# Altium schematic sheet 6_USB_PCIe_STAT PHY.schdoc
size 431 x 309 mm; Symbol: Sheet-Symbol_A4; Device: Sheet-Symbol_A4; Company: 嘉立创EDA; Version: V1.0; Page Size: A4; @Project Name: RK3568核心板; @Page Count: 13; @Update Date: 2024-10-10; @Create Date: 2024-10-09; @Schematic Name: Schematic1; @Page No: 5; @Page Name: USB/PCIe/STAT PHY; @Board Name: Board1; @Create Time: 16:47:07; @Update Time: 09:52:56; Width: 1655; Height: 1170; Region Start: 1; X Region Count: 6; Y Region Count: 4; Blade Width: 10; Title Block Position: 3
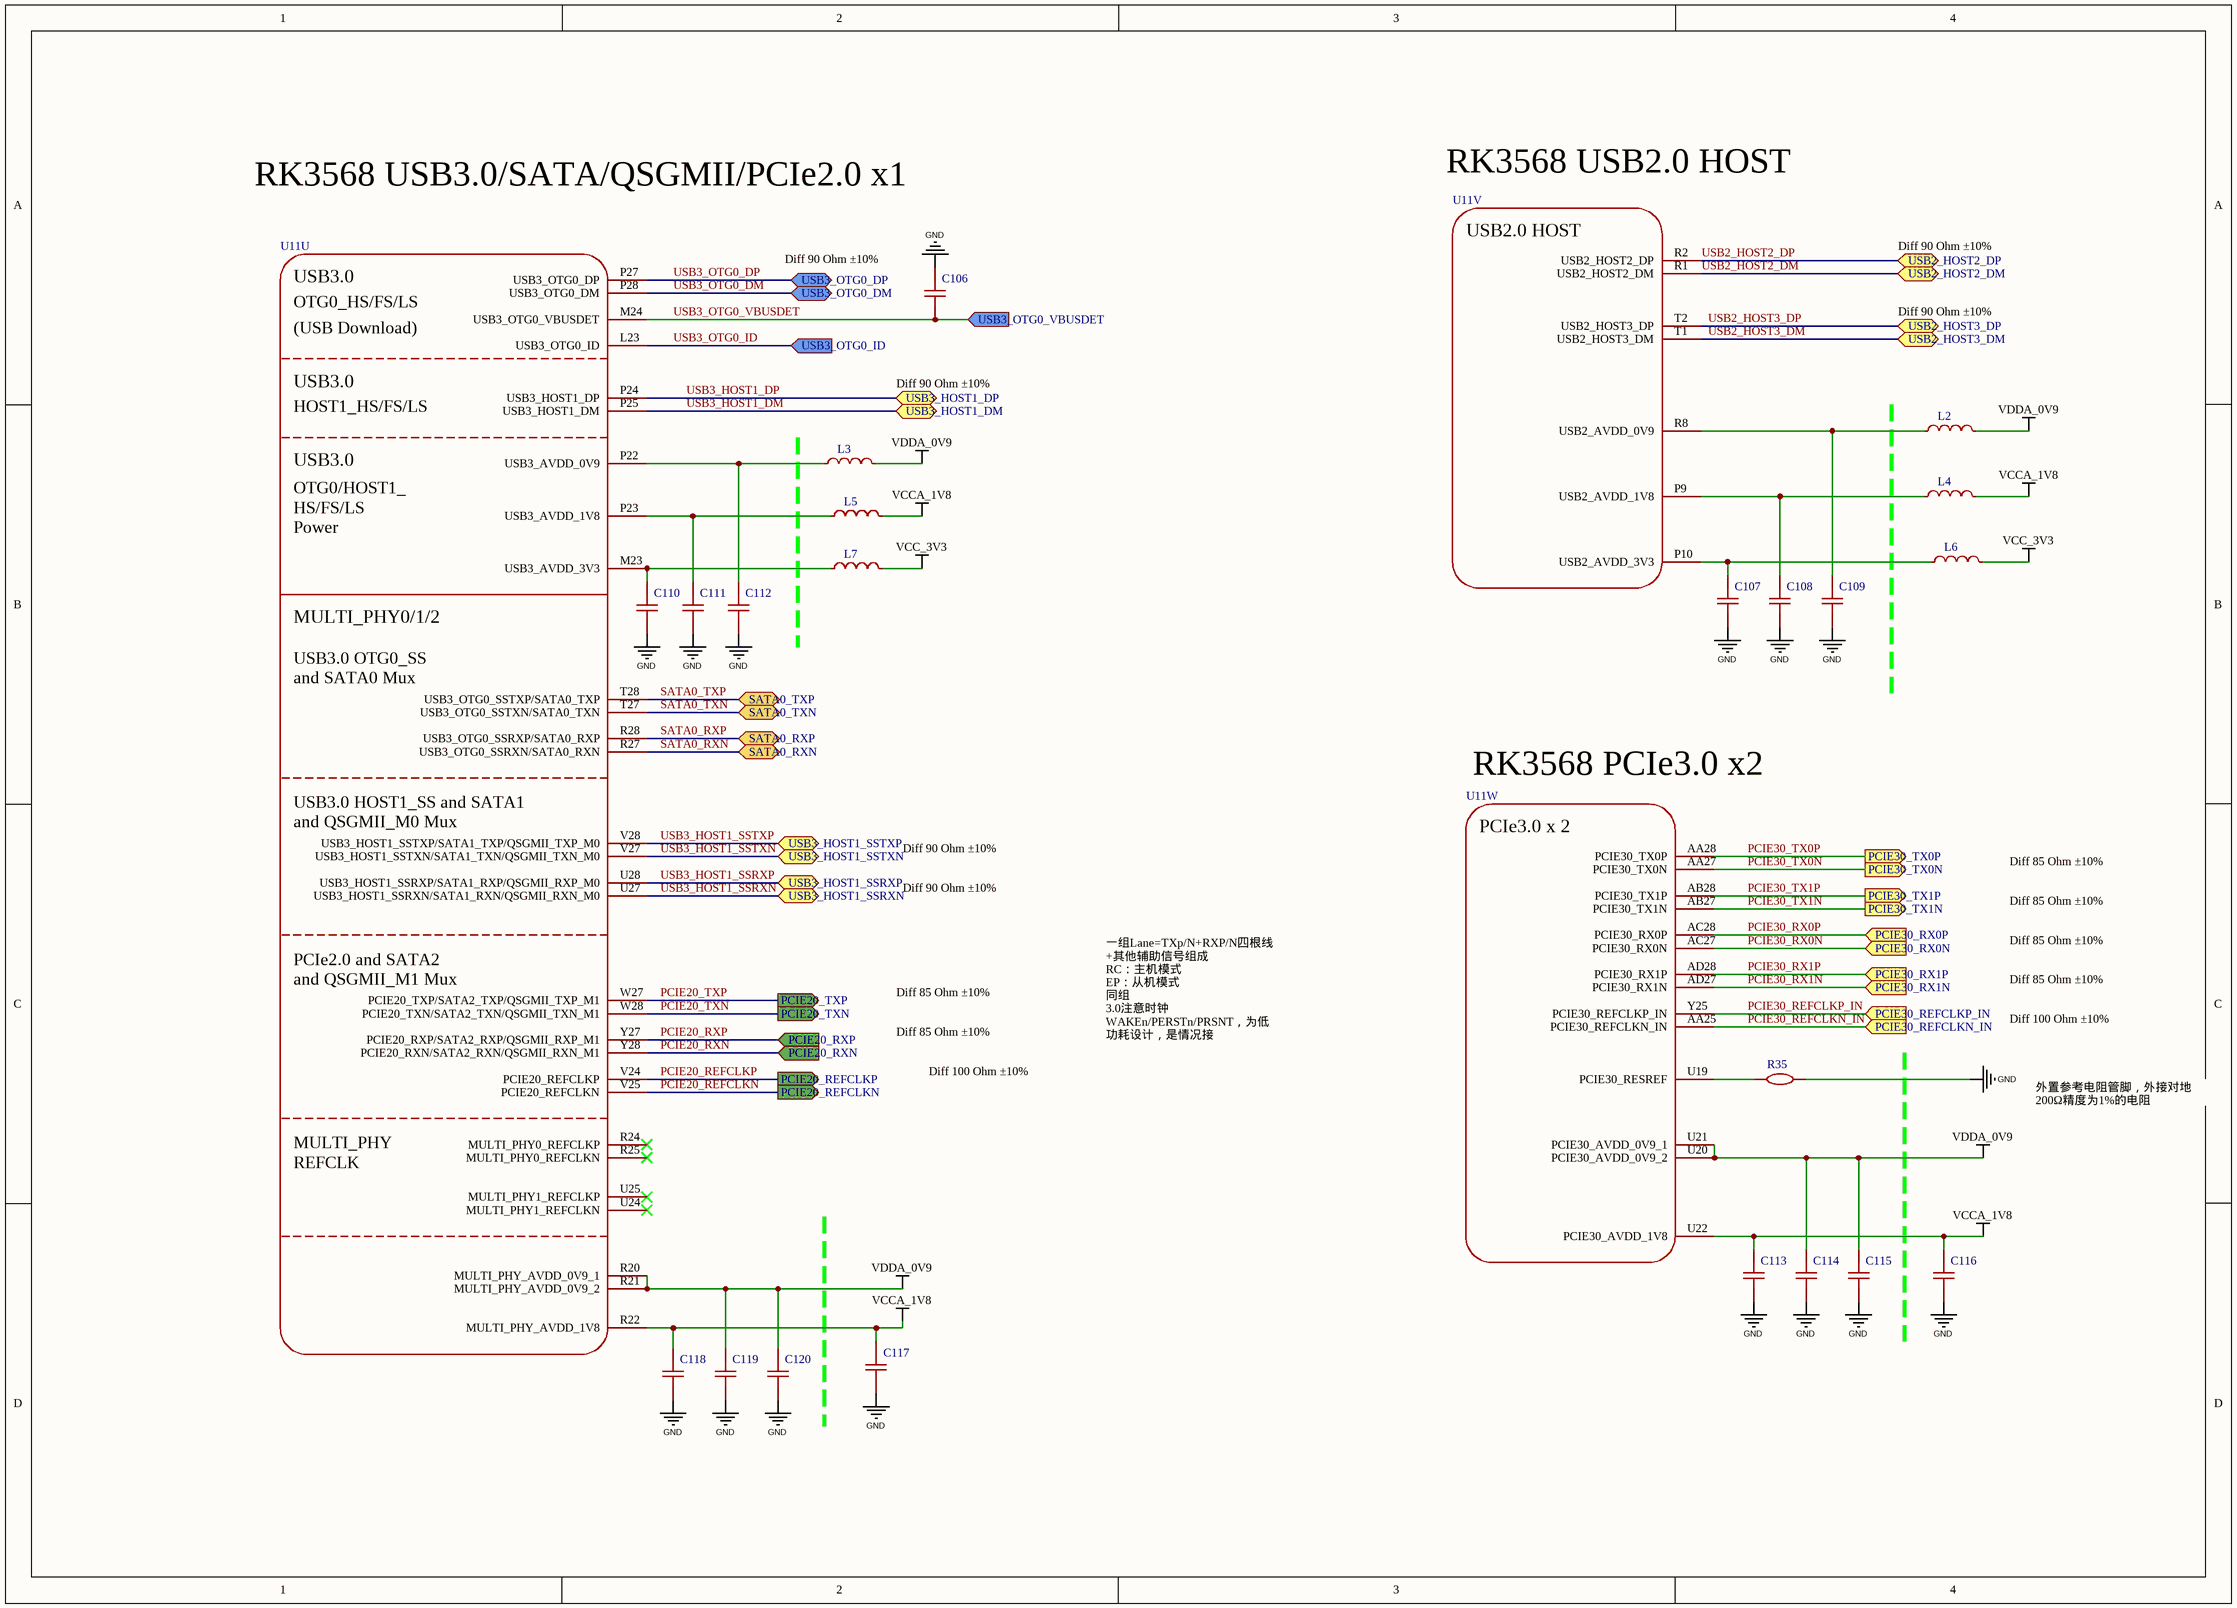
[diagram p0: 6_USB_PCIe_STAT PHY.schdoc]

## Parts
C106  100nF  [C0201]  (value not drawn)
C107  100nF  [C0201]  (value not drawn)
C108  100nF  [C0201]  (value not drawn)
C109  100nF  [C0201]  (value not drawn)
C110  100nF  [C0201]  (value not drawn)
C111  100nF  [C0201]  (value not drawn)
C112  100nF  [C0201]  (value not drawn)
C113  100nF  [C0201]  (value not drawn)
C114  100nF  [C0201]  (value not drawn)
C115  100nF  [C0201]  (value not drawn)
C116  4.7uF  [C0201]  (value not drawn)
C117  4.7uF  [C0201]  (value not drawn)
C118  100nF  [C0201]  (value not drawn)
C119  100nF  [C0201]  (value not drawn)
C120  4.7uF  [C0201]  (value not drawn)
L2  120R 100MHz  [L0603]  (value not drawn)
L3  120R 100MHz  [L0603]  (value not drawn)
L4  120R 100MHz  [L0603]  (value not drawn)
L5  120R 100MHz  [L0603]  (value not drawn)
L6  120R 100MHz  [L0603]  (value not drawn)
L7  120R 100MHz  [L0603]  (value not drawn)
R35  200Ω  [R0402]  (value not drawn)
U11  SOC_RK3568  [RK3568]  (value not drawn)  (parts U,V,W of 23)

## Ports
PCIE20_REFCLKN (out), PCIE20_REFCLKP (out), PCIE20_RXN (in), PCIE20_RXP (in), PCIE20_TXN (out), PCIE20_TXP (out), PCIE30_REFCLKN_IN (in), PCIE30_REFCLKP_IN (in), PCIE30_RX0N (in), PCIE30_RX0P (in), PCIE30_RX1N (in), PCIE30_RX1P (in), PCIE30_TX0N (out), PCIE30_TX0P (out), PCIE30_TX1N (out), PCIE30_TX1P (out), SATA0_RXN (bidir), SATA0_RXP (bidir), SATA0_TXN (bidir), SATA0_TXP (bidir), USB2_HOST2_DM (bidir), USB2_HOST2_DP (bidir), USB2_HOST3_DM (bidir), USB2_HOST3_DP (bidir), USB3_HOST1_DM (bidir), USB3_HOST1_DP (bidir), USB3_HOST1_SSRXN (bidir), USB3_HOST1_SSRXP (bidir), USB3_HOST1_SSTXN (bidir), USB3_HOST1_SSTXP (bidir), USB3_OTG0_DM (bidir), USB3_OTG0_DP (bidir), USB3_OTG0_ID (in), USB3_OTG0_VBUSDET (in)

## Nets
GND: C106.2 C107.1 C108.1 C109.1 C110.1 C111.1 C112.1 C113.1 C114.1 C115.1 C116.1 C117.1 C118.1 C119.1 C120.1 R35.2
VCC_3V3: L6.2 L7.2
VCCA_1V8: C113.2 C116.2 C117.2 C118.2 L4.2 L5.2 U11.R22(MULTI_PHY_AVDD_1V8) U11.U22(PCIE30_AVDD_1V8)
VDDA_0V9: C114.2 C115.2 C119.2 C120.2 L2.2 L3.2 U11.R20(MULTI_PHY_AVDD_0V9_1) U11.R21(MULTI_PHY_AVDD_0V9_2) U11.U20(PCIE30_AVDD_0V9_2) U11.U21(PCIE30_AVDD_0V9_1)
PCIE20_REFCLKN: U11.V25(PCIE20_REFCLKN) ; port PCIE20_REFCLKN
PCIE20_REFCLKP: U11.V24(PCIE20_REFCLKP) ; port PCIE20_REFCLKP
PCIE20_RXN: U11.Y28(PCIE20_RXN/SATA2_RXN/QSGMII_RXN_M1) ; port PCIE20_RXN
PCIE20_RXP: U11.Y27(PCIE20_RXP/SATA2_RXP/QSGMII_RXP_M1) ; port PCIE20_RXP
PCIE20_TXN: U11.W28(PCIE20_TXN/SATA2_TXN/QSGMII_TXN_M1) ; port PCIE20_TXN
PCIE20_TXP: U11.W27(PCIE20_TXP/SATA2_TXP/QSGMII_TXP_M1) ; port PCIE20_TXP
PCIE30_REFCLKN_IN: U11.AA25(PCIE30_REFCLKN_IN) ; port PCIE30_REFCLKN_IN
PCIE30_REFCLKP_IN: U11.Y25(PCIE30_REFCLKP_IN) ; port PCIE30_REFCLKP_IN
PCIE30_RX0N: U11.AC27(PCIE30_RX0N) ; port PCIE30_RX0N
PCIE30_RX0P: U11.AC28(PCIE30_RX0P) ; port PCIE30_RX0P
PCIE30_RX1N: U11.AD27(PCIE30_RX1N) ; port PCIE30_RX1N
PCIE30_RX1P: U11.AD28(PCIE30_RX1P) ; port PCIE30_RX1P
PCIE30_TX0N: U11.AA27(PCIE30_TX0N) ; port PCIE30_TX0N
PCIE30_TX0P: U11.AA28(PCIE30_TX0P) ; port PCIE30_TX0P
PCIE30_TX1N: U11.AB27(PCIE30_TX1N) ; port PCIE30_TX1N
PCIE30_TX1P: U11.AB28(PCIE30_TX1P) ; port PCIE30_TX1P
SATA0_RXN: U11.R27(USB3_OTG0_SSRXN/SATA0_RXN) ; port SATA0_RXN
SATA0_RXP: U11.R28(USB3_OTG0_SSRXP/SATA0_RXP) ; port SATA0_RXP
SATA0_TXN: U11.T27(USB3_OTG0_SSTXN/SATA0_TXN) ; port SATA0_TXN
SATA0_TXP: U11.T28(USB3_OTG0_SSTXP/SATA0_TXP) ; port SATA0_TXP
USB2_HOST2_DM: U11.R1(USB2_HOST2_DM) ; port USB2_HOST2_DM
USB2_HOST2_DP: U11.R2(USB2_HOST2_DP) ; port USB2_HOST2_DP
USB2_HOST3_DM: U11.T1(USB2_HOST3_DM) ; port USB2_HOST3_DM
USB2_HOST3_DP: U11.T2(USB2_HOST3_DP) ; port USB2_HOST3_DP
USB3_HOST1_DM: U11.P25(USB3_HOST1_DM) ; port USB3_HOST1_DM
USB3_HOST1_DP: U11.P24(USB3_HOST1_DP) ; port USB3_HOST1_DP
USB3_HOST1_SSRXN: U11.U27(USB3_HOST1_SSRXN/SATA1_RXN/QSGMII_RXN_M0) ; port USB3_HOST1_SSRXN
USB3_HOST1_SSRXP: U11.U28(USB3_HOST1_SSRXP/SATA1_RXP/QSGMII_RXP_M0) ; port USB3_HOST1_SSRXP
USB3_HOST1_SSTXN: U11.V27(USB3_HOST1_SSTXN/SATA1_TXN/QSGMII_TXN_M0) ; port USB3_HOST1_SSTXN
USB3_HOST1_SSTXP: U11.V28(USB3_HOST1_SSTXP/SATA1_TXP/QSGMII_TXP_M0) ; port USB3_HOST1_SSTXP
USB3_OTG0_DM: U11.P28(USB3_OTG0_DM) ; port USB3_OTG0_DM
USB3_OTG0_DP: U11.P27(USB3_OTG0_DP) ; port USB3_OTG0_DP
USB3_OTG0_ID: U11.L23(USB3_OTG0_ID) ; port USB3_OTG0_ID
USB3_OTG0_VBUSDET: C106.1 U11.M24(USB3_OTG0_VBUSDET) ; port USB3_OTG0_VBUSDET
NetC107_2: C107.2 L6.1 U11.P10(USB2_AVDD_3V3)
NetC108_2: C108.2 L4.1 U11.P9(USB2_AVDD_1V8)
NetC109_2: C109.2 L2.1 U11.R8(USB2_AVDD_0V9)
NetC110_2: C110.2 L7.1 U11.M23(USB3_AVDD_3V3)
NetC111_2: C111.2 L5.1 U11.P23(USB3_AVDD_1V8)
NetC112_2: C112.2 L3.1 U11.P22(USB3_AVDD_0V9)
NetR35_1: R35.1 U11.U19(PCIE30_RESREF)

Not connected (* = marked no-connect by the designer): U11 R24(MULTI_PHY0_REFCLKP)* R25(MULTI_PHY0_REFCLKN)* U24(MULTI_PHY1_REFCLKN)* U25(MULTI_PHY1_REFCLKP)*

## Notes on the sheet
- RK3568 USB3.0/SATA/QSGMII/PCIe2.0 x1
- RK3568 USB2.0 HOST
- Diff 90 Ohm ±10%
- RK3568 PCIe3.0 x2
- Diff 85 Ohm ±10%
- Diff 100 Ohm ±10%
- 外置参考电阻管脚，外接对地200Ω精度为1%的电阻
- 一组Lane=TXp/N+RXP/N四根线+其他辅助信号组成
  RC：主机模式
  EP：从机模式
  同组
  3.0注意时钟
  WAKEn/PERSTn/PRSNT，为低功耗设计，是情况接
- 1
- 2
- 3
- 4
- 5
- 6
- A
- B
- C
- D
- 原理图
- Schematic1
- 创建日期
- 更新日期
- 2024-10-10
- 2024-10-09
- 审阅
- 绘制
- 图页
- USB/PCIe/STAT PHY
- 物料编码
- RK3568核心板
- 版本
- 尺寸
- 页
- 共
- 13
- V1.0
- A4
- 嘉立创EDA
- (in symbol SOC_RK3568, part U) USB3.0; OTG0_HS/FS/LS; (USB Download); HOST1_HS/FS/LS; OTG0/HOST1_ / HS/FS/LS / Power; MULTI_PHY0/1/2; USB3.0 OTG0_SS / and SATA0 Mux; USB3.0 HOST1_SS and SATA1 / and QSGMII_M0 Mux; PCIe2.0 and SATA2 / and QSGMII_M1 Mux; MULTI_PHY / REFCLK
- (in symbol SOC_RK3568, part V) USB2.0 HOST
- (in symbol SOC_RK3568, part W) PCIe3.0 x 2

## Library data of the parts
C106-C115 C118 C119 = CL03A104KO3NNNC: 容值:100nF;精度:±10%;额定电压:16V;材质(温度系数):X5R;; Manufacturer: SAMSUNG(三星); Add into BOM: yes; Tolerance: ±10%; Voltage Rated: 16V; Temperature Coefficient: X5R; Symbol: CL03A104KO3NNNC; Device: CL03A104KO3NNNC; LCSC Part Name: 100nF ±10% 16V; Supplier Part: C307380; Manufacturer Part: CL03A104KO3NNNC; Supplier Footprint: 0201; JLCPCB Part Class: 扩展库; Datasheet: https://atta.szlcsc.com/upload/public/pdf/source/20160218/1457707763339.pdf; Supplier: LCSC; Convert to PCB: yes; Value: 100nF
C116 C117 C120 = GRM035R60J475ME15D: 容值:4.7uF;精度:±20%;额定电压:6.3V;材质(温度系数):X5R;; Manufacturer: muRata(村田); Add into BOM: yes; Tolerance: ±20%; Voltage Rated: 6.3V; Temperature Coefficient: X5R; Symbol: GRM035R60J475ME15D; Device: GRM035R60J475ME15D; LCSC Part Name: 4.7uF ±20% 6.3V; Supplier Part: C335103; Manufacturer Part: GRM035R60J475ME15D; Supplier Footprint: 0201; JLCPCB Part Class: 扩展库; Datasheet: https://atta.szlcsc.com/upload/public/pdf/source/20200305/C490387_23319AE8C154DEB24C505E6C82A8106A.pdf; Supplier: LCSC; Convert to PCB: yes; Value: 4.7uF
L2-L7 = BLM18PG121SN1D: 标称阻抗@测试频率:120Ω@100MHz;误差:±25%;直流电阻(RDC):50mΩ;; Manufacturer: muRata(村田); Symbol: BLM18PG121SN1D_C14709; Add into BOM: yes; Tolerance: ±25%; DC Resistance: 50mΩ; Current Rating: 2A; Circuits: 1; Device: BLM18PG121SN1D; LCSC Part Name: 单路 0603磁珠 阻抗120Ω@100MHz; Supplier Part: C14709; Manufacturer Part: 120R 100MHz; Supplier Footprint: 0603; JLCPCB Part Class: 扩展库; Datasheet: https://atta.szlcsc.com/upload/public/pdf/source/20130704/1457706621422.pdf; Supplier: LCSC; Convert to PCB: yes; Impedance @ Frequency: 120Ω@100MHz
R35 = 0402WGF2000TCE: 电阻类型:厚膜电阻;阻值:200Ω;精度:±1%;功率:62.5mW;最大工作电压:50V;温度系数:±100ppm/℃;; Manufacturer: UNI-ROYAL(厚声); Add into BOM: yes; Tolerance: ±1%; Power(Watts): 62.5mW; Overload Voltage (Max): 50V; Symbol: 0402WGF2000TCE; Device: 0402WGF2000TCE; Supplier: LCSC; Manufacturer Part: 0402WGF2000TCE; Supplier Part: C25087; Value: 200Ω; JLCPCB Part Class: 基础库; LCSC Part Name: 200Ω ±1% 62.5mW 厚膜电阻; Supplier Footprint: 0402; Datasheet: https://atta.szlcsc.com/upload/public/pdf/source/20200306/C422600_1E6D84923E4A46A82E41ADD87F860B5C.pdf; Convert to PCB: yes; Type: 厚膜电阻; Temperature Coefficient: ±100ppm/℃; Operating Temperature Range: -55℃~+155℃
U11 = SOC_RK3568: Part Reference: U1000; Manufacturer: Rockchip (瑞芯微); PCB footprint: BGA636_19R00X19R00X1R20; SWAP_INFO: (S1+S2+S3+S4+S5+S6+S7+S8+S9+S10+S11+S12+S13+S14+S15+S16+S17+S18+S19+S20+S21+S22+S23); SPLIT_INST: TRUE; Value: RK3568; Priority: A; Add into BOM: yes; Relevance: []; Symbol: SOC_RK3568; Device: SOC_RK3568; RK PN: RK3568; Part Type: SOC; Manufacturer PN: RK3568; Created by: JJJ; Origin Footprint 2: BGA636_19R00X19R00X1R20; Convert to PCB: yes